# Altium schematic sheet 01_BLOCK_DIAGRAM.SchDoc: Block Diagram
size 420 x 297 mm; Author: T. Ludemann; SheetNumber: 1; SheetTotal: 5; DocSize: DINA2
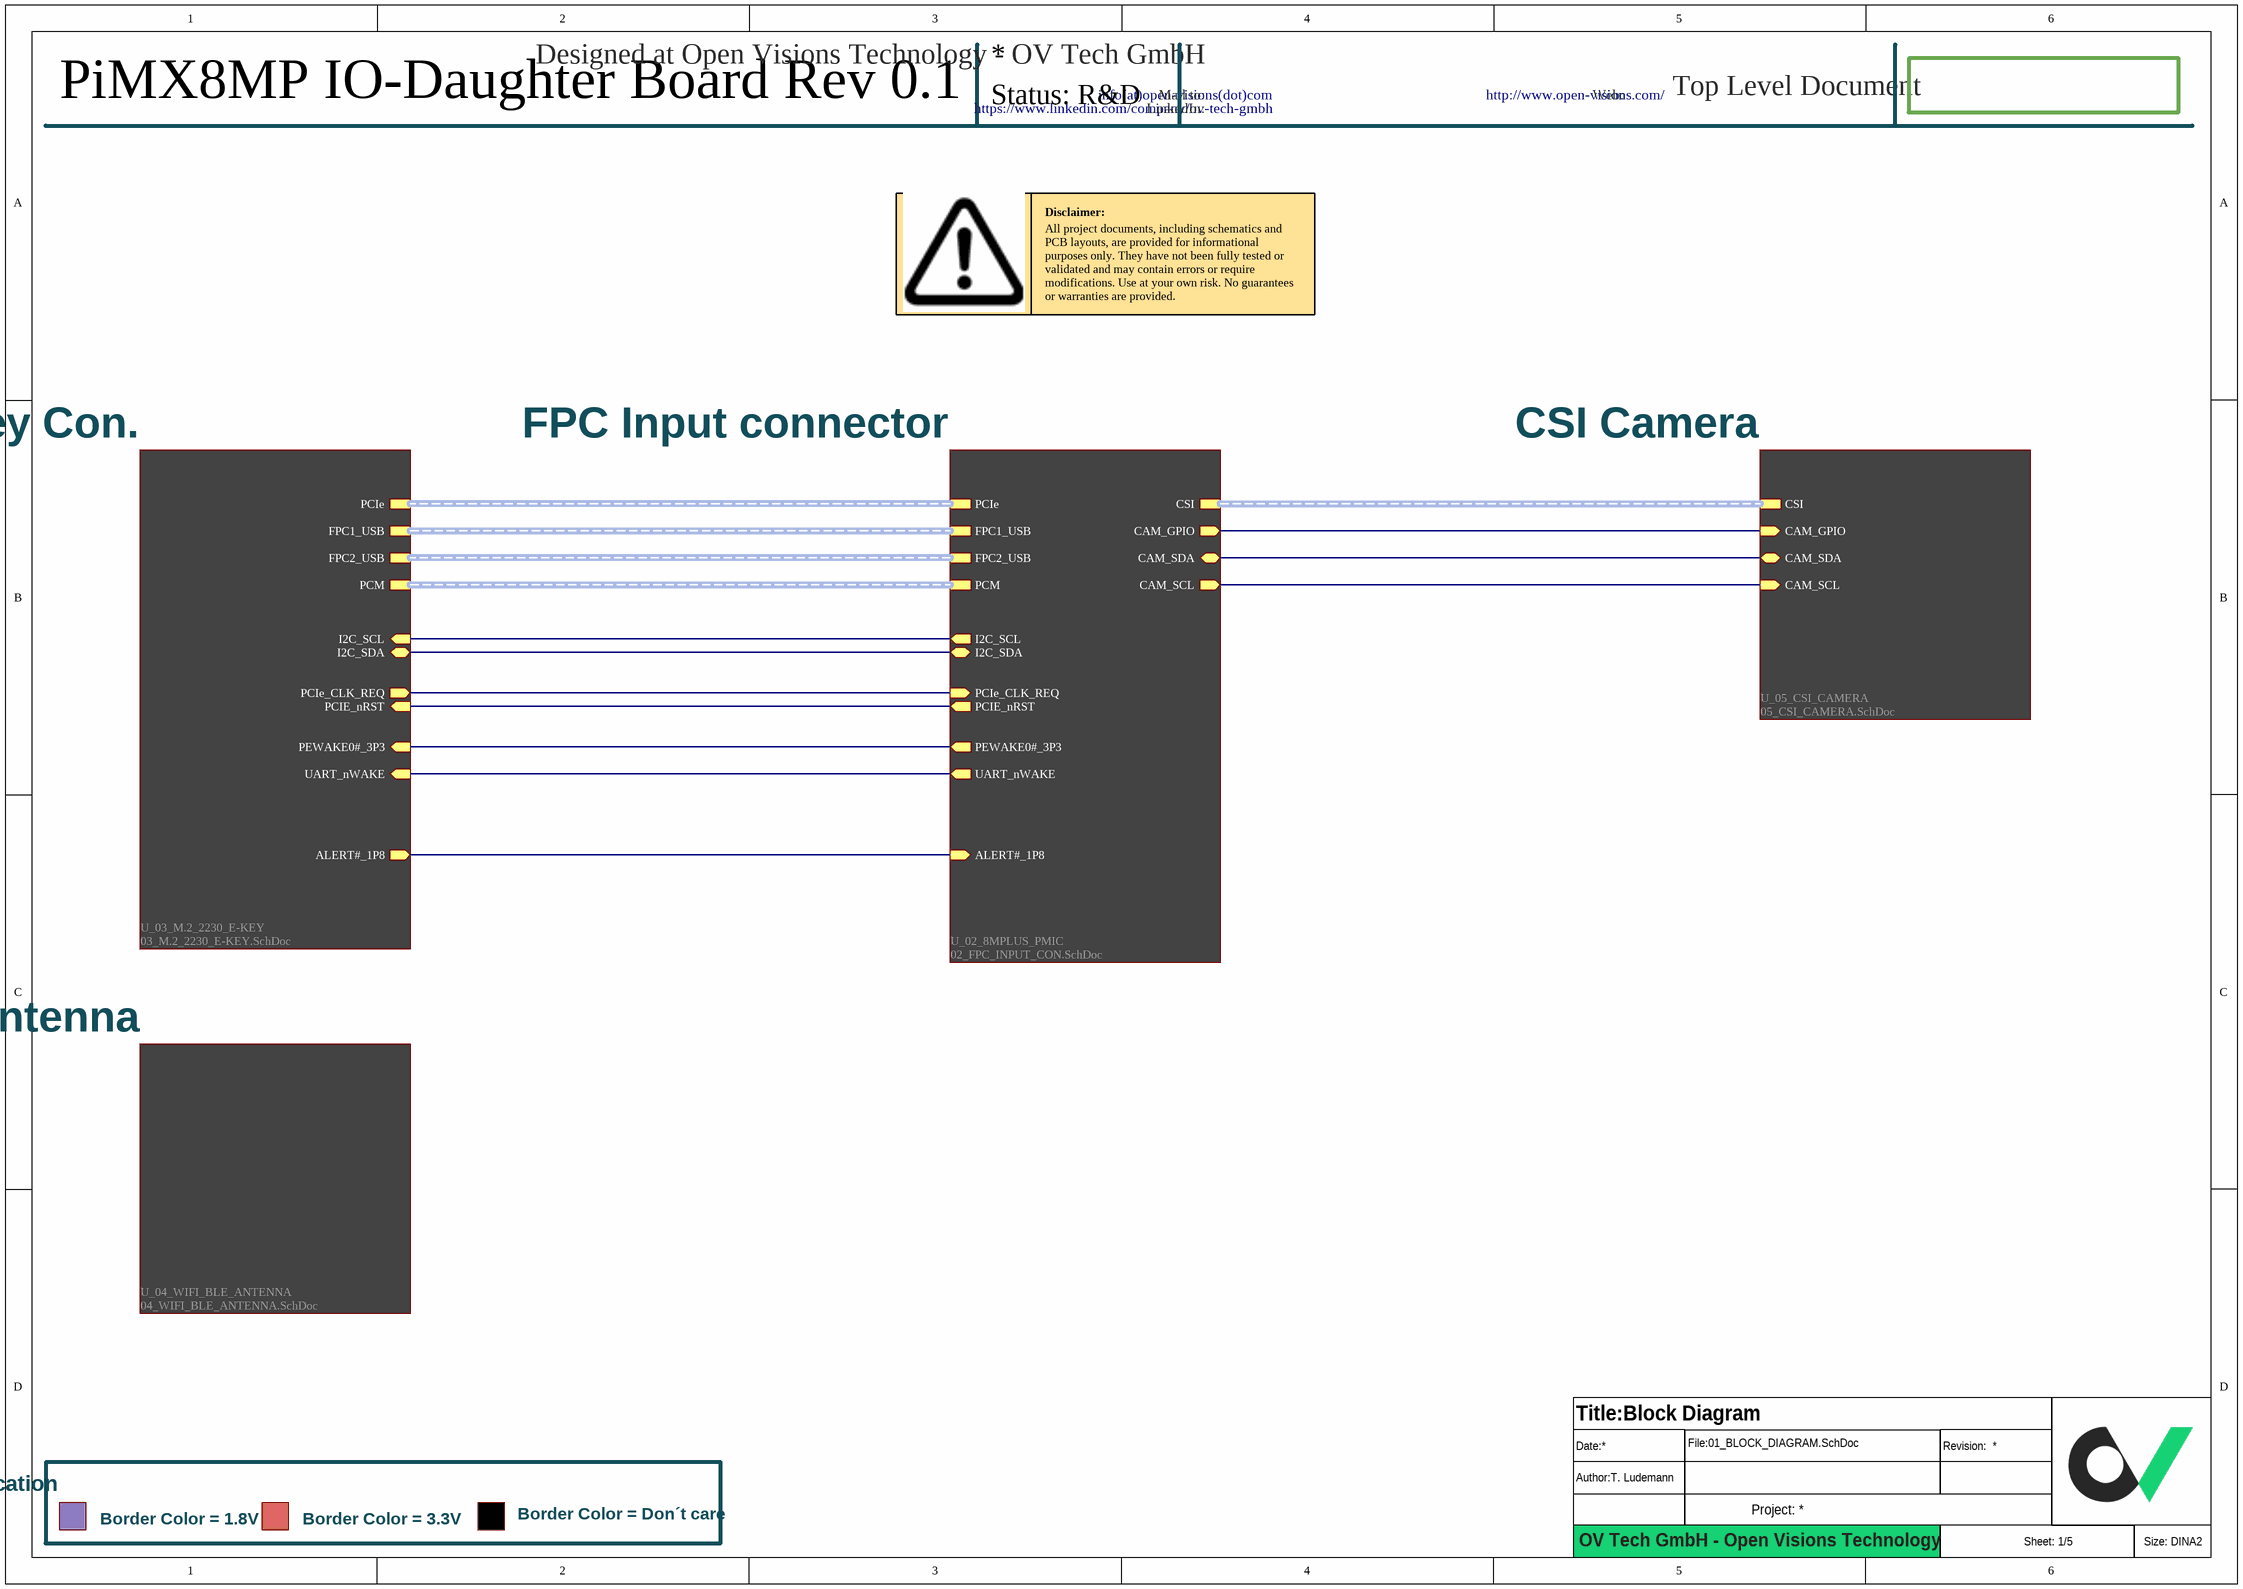
[diagram p0: 01_BLOCK_DIAGRAM.SchDoc]

## Parts
?  (no value)  (graphical)

## Sub-sheets
U_02_8MPLUS_PMIC = 02_FPC_INPUT_CON.SchDoc: CSI (harness CSI), PCIe (harness PCIe), FPC1_USB (harness FPC1_USB), FPC2_USB (harness FPC2_USB), PCIe_CLK_REQ (in), PCIE_nRST (out), PEWAKE0#_3P3 (out), ALERT#_1P8 (in), I2C_SCL (out), I2C_SDA (bidir), PCM (harness PCM), UART_nWAKE (out), CAM_GPIO (out), CAM_SDA (bidir), CAM_SCL (out)
U_03_M.2_2230_E-KEY = 03_M.2_2230_E-KEY.SchDoc: FPC1_USB (harness FPC1_USB), PCIe (harness PCIe), PCM (harness PCM), I2C_SCL (in), I2C_SDA (bidir), PCIe_CLK_REQ (out), PCIE_nRST (in), PEWAKE0#_3P3 (in), UART_nWAKE (in), FPC2_USB (harness FPC2_USB), ALERT#_1P8 (out)
U_04_WIFI_BLE_ANTENNA = 04_WIFI_BLE_ANTENNA.SchDoc: no entries
U_05_CSI_CAMERA = 05_CSI_CAMERA.SchDoc: CSI (harness CSI), CAM_GPIO (in), CAM_SDA (bidir), CAM_SCL (in)

## Nets
(unnamed): sheet U_02_8MPLUS_PMIC/PCIe_CLK_REQ, sheet U_03_M.2_2230_E-KEY/PCIe_CLK_REQ
(unnamed): sheet U_02_8MPLUS_PMIC/PCIE_nRST, sheet U_03_M.2_2230_E-KEY/PCIE_nRST
(unnamed): sheet U_02_8MPLUS_PMIC/PEWAKE0#_3P3, sheet U_03_M.2_2230_E-KEY/PEWAKE0#_3P3
(unnamed): sheet U_02_8MPLUS_PMIC/ALERT#_1P8, sheet U_03_M.2_2230_E-KEY/ALERT#_1P8
(unnamed): sheet U_02_8MPLUS_PMIC/I2C_SCL, sheet U_03_M.2_2230_E-KEY/I2C_SCL
(unnamed): sheet U_02_8MPLUS_PMIC/I2C_SDA, sheet U_03_M.2_2230_E-KEY/I2C_SDA
(unnamed): sheet U_02_8MPLUS_PMIC/UART_nWAKE, sheet U_03_M.2_2230_E-KEY/UART_nWAKE
(unnamed): sheet U_02_8MPLUS_PMIC/CAM_GPIO, sheet U_05_CSI_CAMERA/CAM_GPIO
(unnamed): sheet U_02_8MPLUS_PMIC/CAM_SDA, sheet U_05_CSI_CAMERA/CAM_SDA
(unnamed): sheet U_02_8MPLUS_PMIC/CAM_SCL, sheet U_05_CSI_CAMERA/CAM_SCL

## Buses and harness runs
harness sheet U_02_8MPLUS_PMIC/CSI = sheet U_05_CSI_CAMERA/CSI
harness sheet U_02_8MPLUS_PMIC/FPC1_USB = sheet U_03_M.2_2230_E-KEY/FPC1_USB
harness sheet U_02_8MPLUS_PMIC/FPC2_USB = sheet U_03_M.2_2230_E-KEY/FPC2_USB
harness sheet U_02_8MPLUS_PMIC/PCIe = sheet U_03_M.2_2230_E-KEY/PCIe
harness sheet U_02_8MPLUS_PMIC/PCM = sheet U_03_M.2_2230_E-KEY/PCM

## Notes on the sheet
- PiMX8MP IO-Daughter Board Rev 0.1
- Status: R&D
- Designed at Open Visions Technology - OV Tech GmbH
- Mail to:
- LinkedIn:
- info(at)open-visions(dot)com
- https://www.linkedin.com/company/ov-tech-gmbh
- Web:
- http://www.open-visions.com/
- Top Level Document
- Disclaimer:
- All project documents, including schematics and PCB layouts, are provided for informational purposes only. They have not been fully tested or validated and may contain errors or require modifications. Use at your own risk. No guarantees or warranties are provided.
- M.2 2230 E-Key Con.
- FPC Input connector
- CSI Camera
- WIFI/BLE Antenna
- Signal Level Indication
- Border Color = 1.8V
- Border Color = 3.3V
- Border Color = Don´t care
- OV Tech GmbH - Open Visions Technology

## Library data of the parts
? = Titleblock_01_OpenSource